# Altium schematic sheet Sheet5.SchDoc
size A
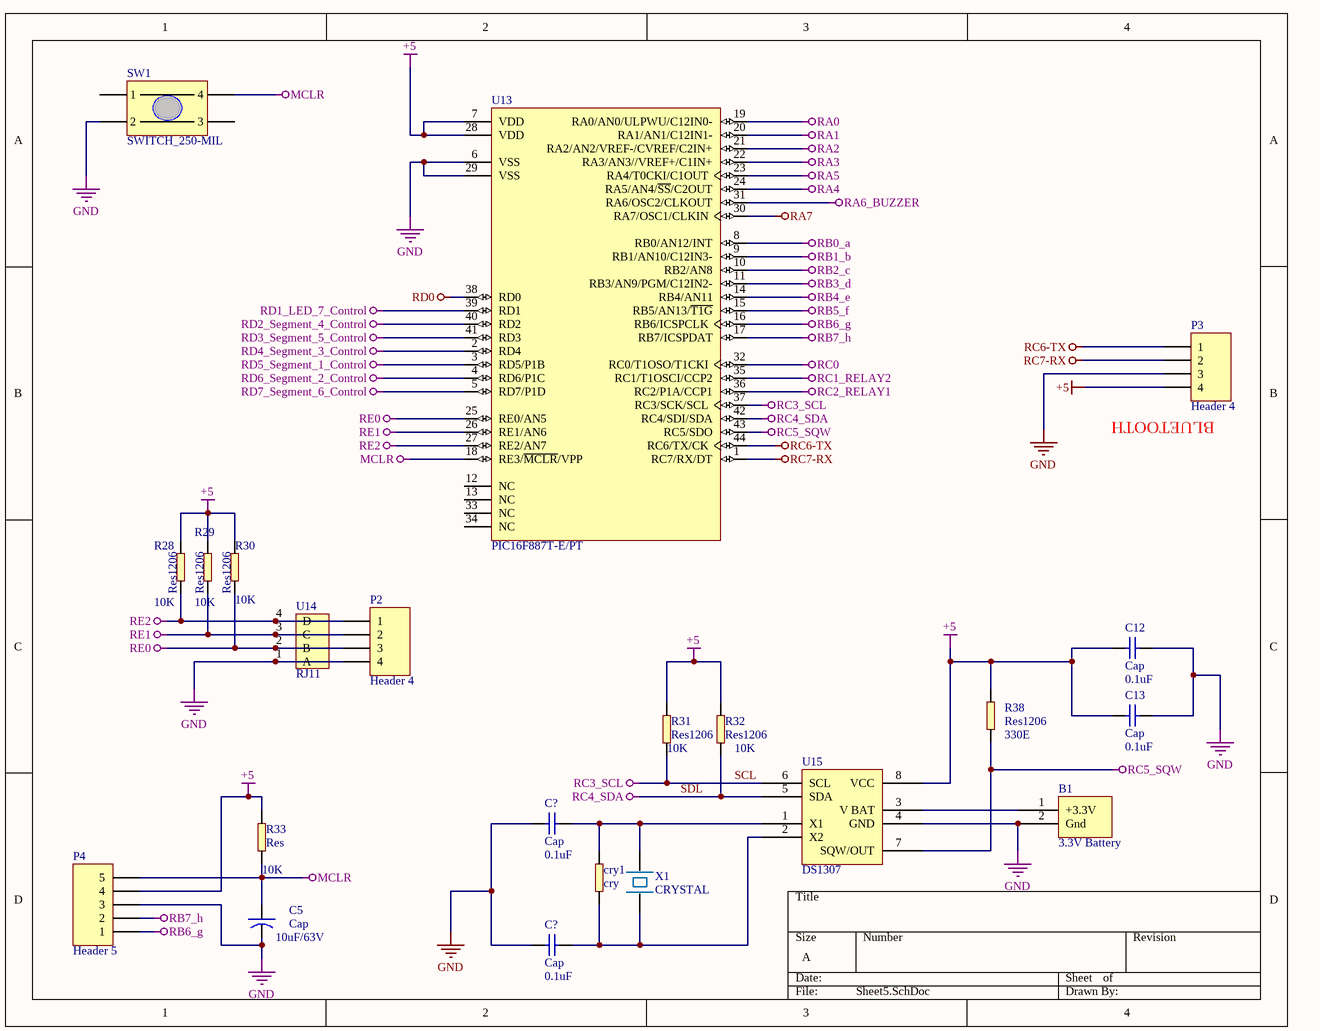
[diagram p0: Sheet5.SchDoc]

## Parts
(Parts that share a designator on the sheet are numbered #1, #2 ... from top to bottom, then left to right.)
B1  3.3V Battery  [CMOS_Battery_H]
C5  Cap  value 10uF/63V  [Capacitor10UF/63V]
C12  Cap  [RES0805]
C13  Cap  [RES0805]
C?#1  Cap  [RES0805]
C?#2  Cap  [RES0805]
cry1  cry  [Res_150mil]
P2  Header 4  [HDR1X4]
P3  Header 4  [HDR1X4]
P4  Header 5  [HDR1X5]
R28  Res1206  value 10K  [1206]
R29  Res1206  value 10K  [1206]
R30  Res1206  value 10K  [1206]
R31  Res1206  value 10K  [1206]
R32  Res1206  value 10K  [1206]
R33  Res  value 10K  [RES0805]
R38  Res1206  value 330E  [1206]
SW1  SWITCH_250-MIL  [switch_200/250]
U13  PIC16F887T-E/PT  [TQFP-PT44_N]
U14  RJ11  [RJ11]
U15  DS1307  [SOIC1307]
X1  CRYSTAL  [CRYSTAL]

## Nets
+5: C12.2(A) C13.2(A) P3.4 P4.4 R28.2(b) R29.2(b) R30.2(b) R31.2(b) R32.2(b) R33.2(b) R38.2(b) U13.7(VDD) U13.28(VDD) U15.8(VCC)
GND: B1.2(Gnd) C5.2(b) C12.1(A) C13.1(A) C?#1.2(A) C?#2.2(A) P2.4 P3.3 P4.3 SW1.2 U13.6(VSS) U13.29(VSS) U14.1(A) U15.4(GND)
MCLR: C5.1(a) P4.5 R33.1(a) SW1.4 U13.18(RE3/~{MCLR}/VPP)
RA0: U13.19(RA0/AN0/ULPWU/C12IN0-)
RA1: U13.20(RA1/AN1/C12IN1-)
RA2: U13.21(RA2/AN2/VREF-/CVREF/C2IN+)
RA3: U13.22(RA3/AN3//VREF+/C1IN+)
RA4: U13.24(RA5/AN4/~{SS}/C2OUT)
RA5: U13.23(RA4/T0CKI/C1OUT)
RA6_BUZZER: U13.31(RA6/OSC2/CLKOUT)
RA7: U13.30(RA7/OSC1/CLKIN)
RB0_a: U13.8(RB0/AN12/INT)
RB1_b: U13.9(RB1/AN10/C12IN3-)
RB2_c: U13.10(RB2/AN8)
RB3_d: U13.11(RB3/AN9/PGM/C12IN2-)
RB4_e: U13.14(RB4/AN11)
RB5_f: U13.15(RB5/AN13/~{T1G})
RB6_g: P4.1 U13.16(RB6/ICSPCLK)
RB7_h: P4.2 U13.17(RB7/ICSPDAT)
RC0: U13.32(RC0/T1OSO/T1CKI)
RC1_RELAY2: U13.35(RC1/T1OSCI/CCP2)
RC2_RELAY1: U13.36(RC2/P1A/CCP1)
RC5_SQW: R38.1(a) U13.43(RC5/SDO) U15.7(SQW/OUT)
RC6-TX: P3.1 U13.44(RC6/TX/CK)
RC7-RX: P3.2 U13.1(RC7/RX/DT)
RD0: U13.38(RD0)
RD1_LED_7_Control: U13.39(RD1)
RD2_Segment_4_Control: U13.40(RD2)
RD3_Segment_5_Control: U13.41(RD3)
RD4_Segment_3_Control: U13.2(RD4)
RD5_Segment_1_Control: U13.3(RD5/P1B)
RD6_Segment_2_Control: U13.4(RD6/P1C)
RD7_Segment_6_Control: U13.5(RD7/P1D)
RE0: P2.3 R30.1(a) U13.25(RE0/AN5) U14.2(B)
RE1: P2.2 R29.1(a) U13.26(RE1/AN6) U14.3(C)
RE2: P2.1 R28.1(a) U13.27(RE2/AN7) U14.4(D)
SCL: R31.1(a) U13.37(RC3/SCK/SCL) U15.6(SCL)  [also labelled RC3_SCL]
SDL: R32.1(a) U13.42(RC4/SDI/SDA) U15.5(SDA)  [also labelled RC4_SDA]
NetB1_1: B1.1(+3.3V) U15.3(V_BAT)
NetC?#1_1: C?#1.1(A) cry1.2(b) U15.1(X1) X1.2(b)
NetC?#2_1: C?#2.1(A) cry1.1(a) U15.2(X2) X1.1(a)

Not connected (* = marked no-connect by the designer): SW1 1 3; U13 12(NC) 13(NC) 33(NC) 34(NC)

## Notes on the sheet
- (near P3) BLUETOOTH
- (in symbol CAP_104_SMD) 0.1uF

## Library data of the parts
B1 = CMOS Battery_H: 3.3V
C5 = Cap-10uf/63V: Cap10uf/63V
C12 C13 C?#1 C?#2 = CAP_104_SMD
cry1 = Res vertical placement
P2 P3 = Header 4: Header, 4-Pin; LatestRevisionDate: 17-Jul-2002; LatestRevisionNote: Re-released for DXP Platform.; Publisher: Altium Limited
P4 = Header 5: Header, 5-Pin; LatestRevisionDate: 17-Jul-2002; LatestRevisionNote: Re-released for DXP Platform.; Publisher: Altium Limited
R33 = Resistor: Res0805
SW1 = SWITCH_250-MIL: 200/250mil Didtance
U13 = PIC16F887T-E/PT: Flash-Based, 8-Bit CMOS Microcontroller with nanoWatt Technology, 8K (x14-Bit words) Program Memory, 624 Bytes Data Memory, 35 I/O pins, 44-Pin TQFP, Standard VDD Range, Extended Temperature, Tape and Reel; Published: 29-Jan-2009; LatestRevisionDate: 02-Dec-2009; LatestRevisionNote: Updated datasheet to version revF, Apr-2009.; DatasheetVersion: revF, Apr-2009; PackageVersion: revBB, Aug-2009; PackageReference: TQFP-PT44; Publisher: Altium Limited; PackageDescription: 44-Lead Plastic Thin Quad Flatpack (PT) - 10x10x1mm Body, 2.00mm [TQFP]; Code_JEDEC: MS-026; ComponentLink1Description: Datasheet; ComponentLink1URL: http://ww1.microchip.com/downloads/en/DeviceDoc/41291F.pdf; ComponentLink2Description: Packaging Specification; ComponentLink2URL: http://www.microchip.com/stellent/groups/techpub_sg/documents/packagingspec/en012702.pdf; ComponentLink3Description: Microchip.com Home; ComponentLink3URL: http://www.microchip.com/
U14 = RJ11 conn